# EAGLE schematic FPGA_Board (EAGLE 6.1)
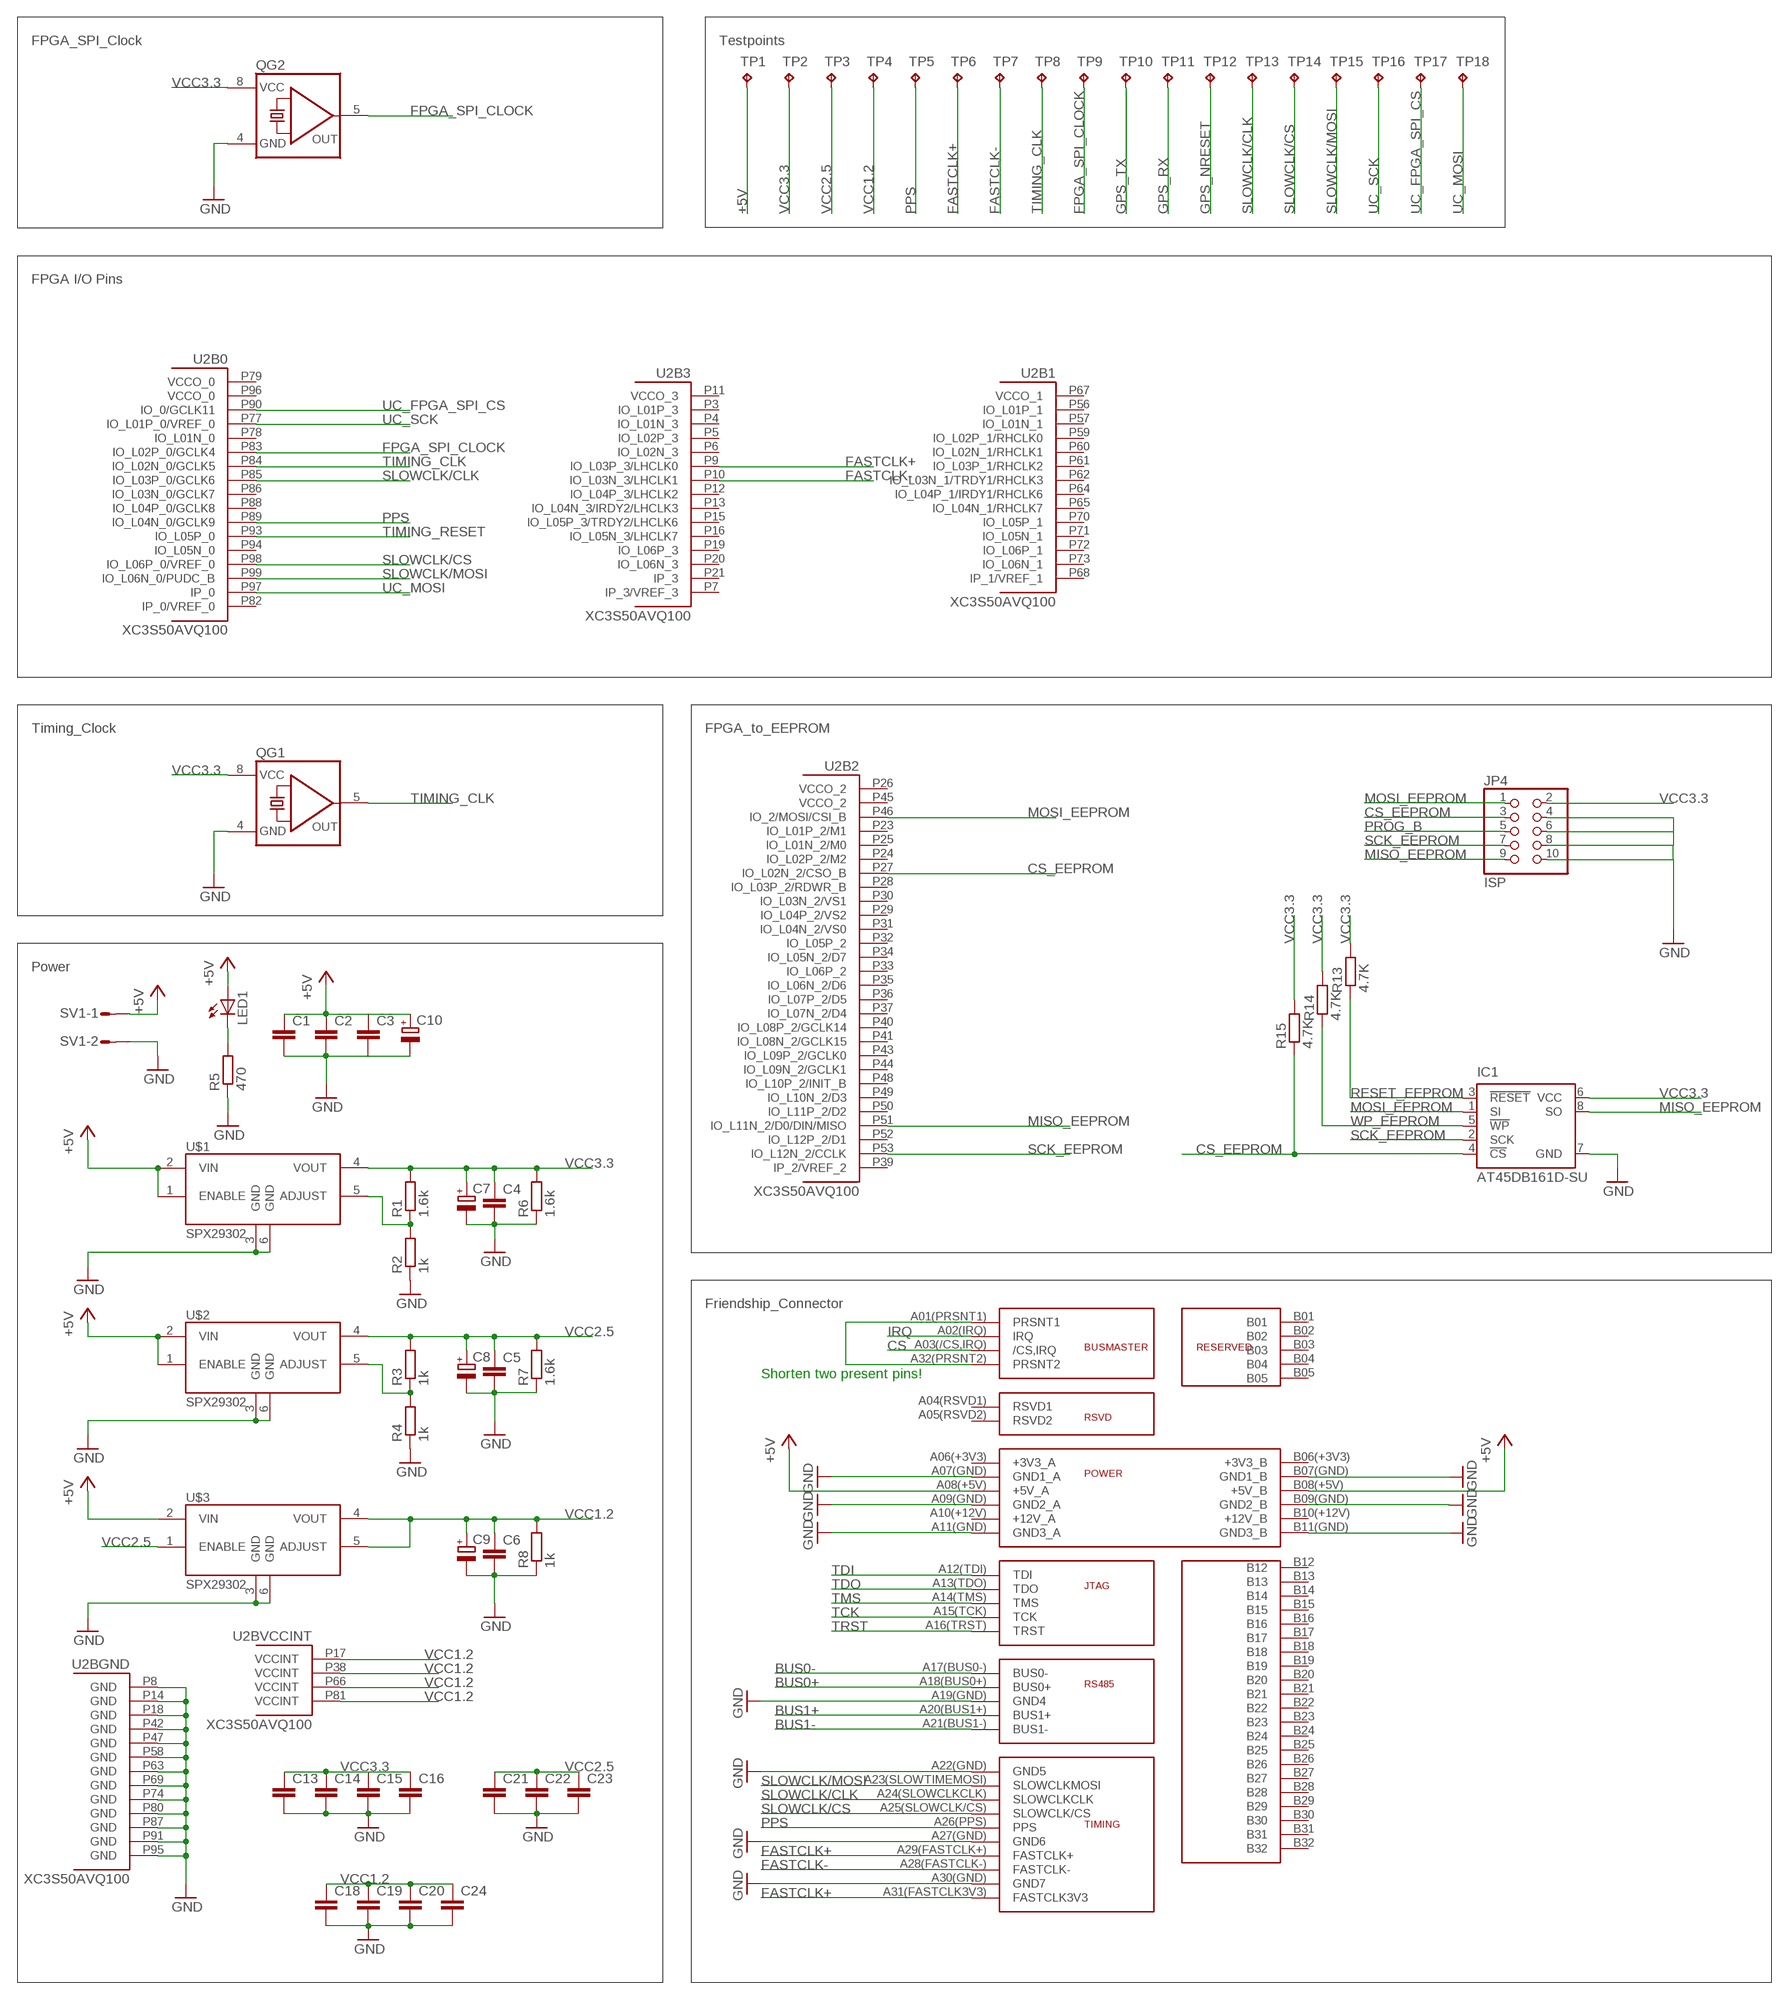
[diagram p0: schematic, sheet 1, part 1 of 2]
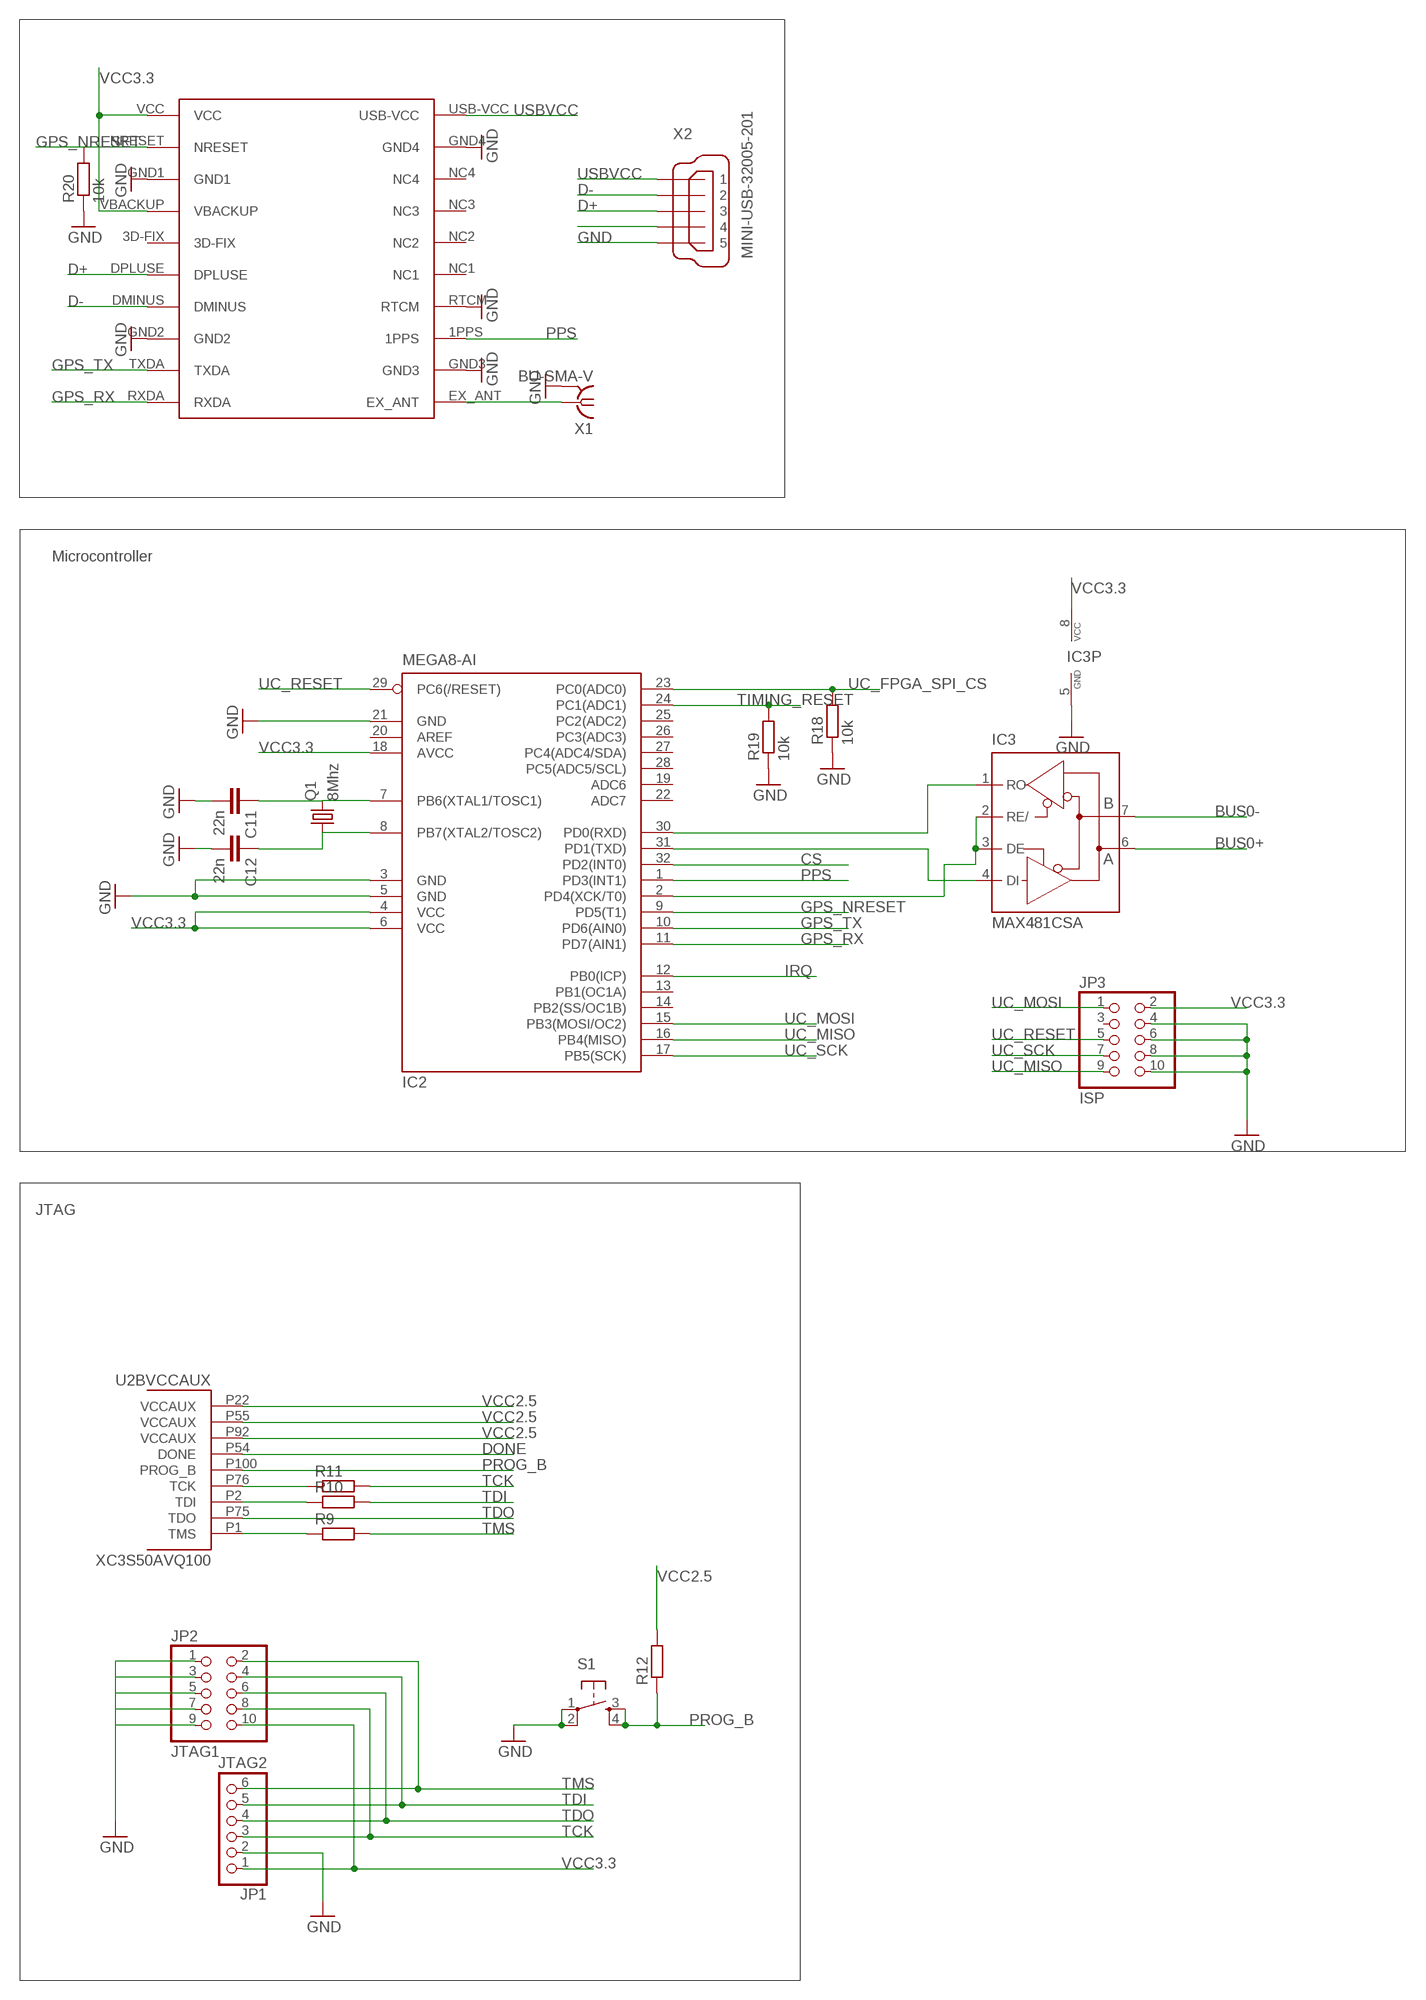
[diagram p1: schematic, sheet 1, part 2 of 2]

## Parts
C1  C-EUC0805  [C0805]
C2  C-EUC0805  [C0805]
C3  C-EUC0805  [C0805]
C4  C-EUC0805  [C0805]
C5  C-EUC0805  [C0805]
C6  C-EUC0805  [C0805]
C7  CPOL-EU085CS-1AR  [085CS_1AR]
C8  CPOL-EU085CS-1AR  [085CS_1AR]
C9  CPOL-EU085CS-1AR  [085CS_1AR]
C10  CPOL-EU085CS-1AR  [085CS_1AR]
C11  22n  C-EUC0805  [C0805]
C12  22n  C-EUC0805  [C0805]
C13  C-EUC0603  [C0603]
C14  C-EUC0603  [C0603]
C15  C-EUC0603  [C0603]
C16  C-EUC0603  [C0603]
C18  C-EUC0603  [C0603]
C19  C-EUC0603  [C0603]
C20  C-EUC0603  [C0603]
C21  C-EUC0603  [C0603]
C22  C-EUC0603  [C0603]
C23  C-EUC0603  [C0603]
C24  C-EUC0603  [C0603]
IC1  AT45DB161D-SU  [8S2]
IC2  MEGA8-AI  [TQFP32-08]
IC3  MAX481CSA  [SO08]
JP1  JTAG2  PINHD-1X6  [1X06]
JP2  JTAG1  PINHD-2X5  [2X05]
JP3  ISP  PINHD-2X5  [2X05]
JP4  ISP  PINHD-2X5  [2X05]
LED1  LEDCHIPLED_0805  [CHIPLED_0805]
Q1  8Mhz  CRYSTALHC49UP  [HC49UP]
QG1  QG5460  [DIL08S]
QG2  QG5460  [DIL08S]
R1  1.6k  R-EU_M0805  [M0805]
R2  1k  R-EU_M0805  [M0805]
R3  1k  R-EU_M0805  [M0805]
R4  1k  R-EU_M0805  [M0805]
R5  470  R-EU_M0805  [M0805]
R6  1.6k  R-EU_M0805  [M0805]
R7  1.6k  R-EU_M0805  [M0805]
R8  1k  R-EU_M0805  [M0805]
R9  R-EU_M0805  [M0805]
R10  R-EU_M0805  [M0805]
R11  R-EU_M0805  [M0805]
R12  R-EU_M0805  [M0805]
R13  4.7K  R-EU_M0805  [M0805]
R14  4.7K  R-EU_M0805  [M0805]
R15  4.7K  R-EU_M0805  [M0805]
R18  10k  R-EU_M0805  [M0805]
R19  10k  R-EU_M0805  [M0805]
R20  10k  R-EU_M0805  [M0805]
S1  TAC_SWITCHPTH  [TACTILE-PTH]
SV1  L02P  [L02P]
TP1  TPB2,54  [B2,54]
TP2  TPB2,54  [B2,54]
TP3  TPB2,54  [B2,54]
TP4  TPB2,54  [B2,54]
TP5  TPB2,54  [B2,54]
TP6  TPB2,54  [B2,54]
TP7  TPB2,54  [B2,54]
TP8  TPB2,54  [B2,54]
TP9  TPB2,54  [B2,54]
TP10  TPB2,54  [B2,54]
TP11  TPB2,54  [B2,54]
TP12  TPB2,54  [B2,54]
TP13  TPB2,54  [B2,54]
TP14  TPB2,54  [B2,54]
TP15  TPB2,54  [B2,54]
TP16  TPB2,54  [B2,54]
TP17  TPB2,54  [B2,54]
TP18  TPB2,54  [B2,54]
U2  XC3S50AVQ100  [VQ100]
U$1  SPX29302  [Q5-DD_SPX29300]
U$2  SPX29302  [Q5-DD_SPX29300]
U$3  SPX29302  [Q5-DD_SPX29300]
U$4  FRIENDSHIPCONNECTOR  [FRIENDSHIP_EDGE_CONNECTOR]
U$5  HGG_LOGO  [HGG_LOGO]
U$6  GPS  [GPS]
X1  BU-SMA-V  [BU-SMA-V]
X2  MINI-USB-32005-201  [32005-201]

## Nets
+5V: C1.1 C2.1 C3.1 C10.+ LED1.A SV1.1 TP1.TP U$1.1(ENABLE) U$1.2(VIN) U$2.1(ENABLE) U$2.2(VIN) U$3.2(VIN) U$4.A08(+5V)(+5V_A) U$4.B08(+5V)(+5V_B)
BUS0+: IC3.6(A) U$4.A18(BUS0+)(BUS0+)
BUS0-: IC3.7(B) U$4.A17(BUS0-)(BUS0-)
BUS1+: U$4.A20(BUS1+)(BUS1+)
BUS1-: U$4.A21(BUS1-)(BUS1-)
CS: IC2.32(PD2(INT0)) U$4.A03(/CS,IRQ)(/CS,IRQ)
CS_EEPROM: IC1.4(!CS) JP4.3 R15.1 U2.P27(B2:IO_L02N_2/CSO_B)
D+: U$6.DPLUSE X2.3
D-: U$6.DMINUS X2.2
DI: IC2.31(PD1(TXD)) IC3.4(DI)
DO: IC2.30(PD0(RXD)) IC3.1(RO)
DONE: U2.P54(BVCCAUX:DONE)
FASTCLK+: TP6.TP U2.P9(B3:IO_L03P_3/LHCLK0) U$4.A29(FASTCLK+)(FASTCLK+) U$4.A31(FASTCLK3V3)(FASTCLK3V3)
FASTCLK-: TP7.TP U2.P10(B3:IO_L03N_3/LHCLK1) U$4.A28(FASTCLK-)(FASTCLK-)
FPGA_SPI_CLOCK: QG2.5(OUT) TP9.TP U2.P83(B0:IO_L02P_0/GCLK4)
GND: C1.2 C2.2 C3.2 C4.2 C5.2 C6.2 C7.- C8.- C9.- C10.- C11.2 C12.2 C13.2 C14.2 C15.2 C16.2 C18.2 C19.2 C20.2 C21.2 C22.2 C23.2 C24.2 IC1.7(GND) IC2.3(GND) IC2.5(GND) IC2.21(GND) IC3.5(GND) JP1.2 JP2.1 JP2.3 JP2.5 JP2.7 JP2.9 JP3.4 JP3.6 JP3.8 JP3.10 JP4.4 JP4.6 JP4.8 JP4.10 QG1.4(GND) QG2.4(GND) R2.1 R4.1 R5.1 R6.1 R7.1 R8.1 R18.1 R19.1 R20.1 S1.1 S1.2 SV1.2 U2.P8(BGND:GND) U2.P14(BGND:GND) U2.P18(BGND:GND) U2.P42(BGND:GND) U2.P47(BGND:GND) U2.P58(BGND:GND) U2.P63(BGND:GND) U2.P69(BGND:GND) U2.P74(BGND:GND) U2.P80(BGND:GND) U2.P87(BGND:GND) U2.P91(BGND:GND) U2.P95(BGND:GND) U$1.3(GND) U$1.6(GND) U$2.3(GND) U$2.6(GND) U$3.3(GND) U$3.6(GND) U$4.A07(GND)(GND1_A) U$4.A09(GND)(GND2_A) U$4.A11(GND)(GND3_A) U$4.A19(GND)(GND4) U$4.A22(GND)(GND5) U$4.A27(GND)(GND6) U$4.A30(GND)(GND7) U$4.B07(GND)(GND1_B) U$4.B09(GND)(GND2_B) U$4.B11(GND)(GND3_B) U$6.GND1 U$6.GND2 U$6.GND3 U$6.GND4 U$6.RTCM X1.2(GND) X2.5
GPS_NRESET: IC2.9(PD5(T1)) R20.2 TP12.TP U$6.NRESET
GPS_RX: IC2.11(PD7(AIN1)) TP11.TP U$6.RXDA
GPS_TX: IC2.10(PD6(AIN0)) TP10.TP U$6.TXDA
IRQ: IC2.12(PB0(ICP)) U$4.A02(IRQ)(IRQ)
MISO_EEPROM: IC1.8(SO) JP4.9 U2.P51(B2:IO_L11N_2/D0/DIN/MISO)
MOSI_EEPROM: IC1.1(SI) JP4.1 U2.P46(B2:IO_2/MOSI/CSI_B)
N$1: R11.1 U2.P76(BVCCAUX:TCK)
N$2: R10.1 U2.P2(BVCCAUX:TDI)
N$3: LED1.C R5.2
N$4: R9.1 U2.P1(BVCCAUX:TMS)
N$5: IC2.2(PD4(XCK/T0)) IC3.2(RE/) IC3.3(DE)
N$7: R1.1 R2.2 U$1.5(ADJUST)
N$8: R3.1 R4.2 U$2.5(ADJUST)
N$11: C11.1 IC2.7(PB6(XTAL1/TOSC1)) Q1.2
N$12: C12.1 IC2.8(PB7(XTAL2/TOSC2)) Q1.1
N$13: U$4.A01(PRSNT1)(PRSNT1) U$4.A32(PRSNT2)(PRSNT2)
N$14: U$6.EX_ANT X1.1
N$15: X2.4
PPS: IC2.1(PD3(INT1)) TP5.TP U2.P89(B0:IO_L04N_0/GCLK9) U$4.A26(PPS)(PPS) U$6.1PPS
PROG_B: JP4.5 R12.1 S1.3 S1.4 U2.P100(BVCCAUX:PROG_B)
RESET_EEPROM: IC1.3(!RESET) R13.1
SCK_EEPROM: IC1.2(SCK) JP4.7 U2.P53(B2:IO_L12N_2/CCLK)
SLOWCLK/CLK: TP13.TP U2.P85(B0:IO_L03P_0/GCLK6) U$4.A24(SLOWCLKCLK)(SLOWCLKCLK)
SLOWCLK/CS: TP14.TP U2.P98(B0:IO_L06P_0/VREF_0) U$4.A25(SLOWCLK/CS)(SLOWCLK/CS)
SLOWCLK/MOSI: TP15.TP U2.P99(B0:IO_L06N_0/PUDC_B) U$4.A23(SLOWTIMEMOSI)(SLOWCLKMOSI)
TCK: JP1.3 JP2.8 R11.2 U$4.A15(TCK)(TCK)
TDI: JP1.5 JP2.4 R10.2 U$4.A12(TDI)(TDI)
TDO: JP1.4 JP2.6 U2.P75(BVCCAUX:TDO) U$4.A13(TDO)(TDO)
TIMING_CLK: QG1.5(OUT) TP8.TP U2.P84(B0:IO_L02N_0/GCLK5)
TIMING_RESET: IC2.24(PC1(ADC1)) R19.2 U2.P93(B0:IO_L05P_0)
TMS: JP1.6 JP2.2 R9.2 U$4.A14(TMS)(TMS)
TRST: U$4.A16(TRST)(TRST)
UC_FPGA_SPI_CS: IC2.23(PC0(ADC0)) R18.2 TP17.TP U2.P90(B0:IO_0/GCLK11)
UC_MISO: IC2.16(PB4(MISO)) JP3.9
UC_MOSI: IC2.15(PB3(MOSI/OC2)) JP3.1 TP18.TP U2.P97(B0:IP_0)
UC_RESET: IC2.29(PC6(/RESET)) JP3.5
UC_SCK: IC2.17(PB5(SCK)) JP3.7 TP16.TP U2.P77(B0:IO_L01P_0/VREF_0)
USBVCC: U$6.USB-VCC X2.1
VCC1.2: C6.1 C9.+ C18.1 C19.1 C20.1 C24.1 R8.2 TP4.TP U2.P17(BVCCINT:VCCINT) U2.P38(BVCCINT:VCCINT) U2.P66(BVCCINT:VCCINT) U2.P81(BVCCINT:VCCINT) U$3.4(VOUT) U$3.5(ADJUST)
VCC2.5: C5.1 C8.+ C21.1 C22.1 C23.1 R3.2 R7.2 R12.2 TP3.TP U2.P22(BVCCAUX:VCCAUX) U2.P55(BVCCAUX:VCCAUX) U2.P92(BVCCAUX:VCCAUX) U$2.4(VOUT) U$3.1(ENABLE)
VCC3.3: C4.1 C7.+ C13.1 C14.1 C15.1 C16.1 IC1.6(VCC) IC2.4(VCC) IC2.6(VCC) IC2.18(AVCC) IC3.8(VCC) JP1.1 JP2.10 JP3.2 JP4.2 QG1.8(VCC) QG2.8(VCC) R1.2 R6.2 R13.2 R14.2 R15.2 TP2.TP U$1.4(VOUT) U$6.VBACKUP U$6.VCC
WP_EEPROM: IC1.5(!WP) R14.1
Unconnected: IC2.13(PB1(OC1A)) IC2.14(PB2(SS/OC1B)) IC2.19(ADC6) IC2.20(AREF) IC2.22(ADC7) IC2.25(PC2(ADC2)) IC2.26(PC3(ADC3)) IC2.27(PC4(ADC4/SDA)) IC2.28(PC5(ADC5/SCL)) JP3.3 U2.P3(B3:IO_L01P_3) U2.P4(B3:IO_L01N_3) U2.P5(B3:IO_L02P_3) U2.P6(B3:IO_L02N_3) U2.P7(B3:IP_3/VREF_3) U2.P11(B3:VCCO_3) U2.P12(B3:IO_L04P_3/LHCLK2) U2.P13(B3:IO_L04N_3/IRDY2/LHCLK3) U2.P15(B3:IO_L05P_3/TRDY2/LHCLK6) U2.P16(B3:IO_L05N_3/LHCLK7) U2.P19(B3:IO_L06P_3) U2.P20(B3:IO_L06N_3) U2.P21(B3:IP_3) U2.P23(B2:IO_L01P_2/M1) U2.P24(B2:IO_L02P_2/M2) U2.P25(B2:IO_L01N_2/M0) U2.P26(B2:VCCO_2) U2.P28(B2:IO_L03P_2/RDWR_B) U2.P29(B2:IO_L04P_2/VS2) U2.P30(B2:IO_L03N_2/VS1) U2.P31(B2:IO_L04N_2/VS0) U2.P32(B2:IO_L05P_2) U2.P33(B2:IO_L06P_2) U2.P34(B2:IO_L05N_2/D7) U2.P35(B2:IO_L06N_2/D6) U2.P36(B2:IO_L07P_2/D5) U2.P37(B2:IO_L07N_2/D4) U2.P39(B2:IP_2/VREF_2) U2.P40(B2:IO_L08P_2/GCLK14) U2.P41(B2:IO_L08N_2/GCLK15) U2.P43(B2:IO_L09P_2/GCLK0) U2.P44(B2:IO_L09N_2/GCLK1) U2.P45(B2:VCCO_2) U2.P48(B2:IO_L10P_2/INIT_B) U2.P49(B2:IO_L10N_2/D3) U2.P50(B2:IO_L11P_2/D2) U2.P52(B2:IO_L12P_2/D1) U2.P56(B1:IO_L01P_1) U2.P57(B1:IO_L01N_1) U2.P59(B1:IO_L02P_1/RHCLK0) U2.P60(B1:IO_L02N_1/RHCLK1) U2.P61(B1:IO_L03P_1/RHCLK2) U2.P62(B1:IO_L03N_1/TRDY1/RHCLK3) U2.P64(B1:IO_L04P_1/IRDY1/RHCLK6) U2.P65(B1:IO_L04N_1/RHCLK7) U2.P67(B1:VCCO_1) U2.P68(B1:IP_1/VREF_1) U2.P70(B1:IO_L05P_1) U2.P71(B1:IO_L05N_1) U2.P72(B1:IO_L06P_1) U2.P73(B1:IO_L06N_1) U2.P78(B0:IO_L01N_0) U2.P79(B0:VCCO_0) U2.P82(B0:IP_0/VREF_0) U2.P86(B0:IO_L03N_0/GCLK7) U2.P88(B0:IO_L04P_0/GCLK8) U2.P94(B0:IO_L05N_0) U2.P96(B0:VCCO_0) U$4.A04(RSVD1)(RSVD1) U$4.A05(RSVD2)(RSVD2) U$4.A06(+3V3)(+3V3_A) U$4.A10(+12V)(+12V_A) U$4.B01 U$4.B02 U$4.B03 U$4.B04 U$4.B05 U$4.B06(+3V3)(+3V3_B) U$4.B10(+12V)(+12V_B) U$4.B12 U$4.B13 U$4.B14 U$4.B15 U$4.B16 U$4.B17 U$4.B18 U$4.B19 U$4.B20 U$4.B21 U$4.B22 U$4.B23 U$4.B24 U$4.B25 U$4.B26 U$4.B27 U$4.B28 U$4.B29 U$4.B30 U$4.B31 U$4.B32 U$6.3D-FIX U$6.NC1 U$6.NC2 U$6.NC3 U$6.NC4

## Notes on the sheet
- FPGA_SPI_Clock | Testpoints
- FPGA I/O Pins
- Timing_Clock | FPGA_to_EEPROM | Microcontroller
- Power
- Friendship_Connector | JTAG
- Shorten two present pins!

## Power pins joined to a net without a drawn wire
GND: X1.3(GND) X1.4(GND) X1.5(GND)

## Library data of the parts
C1-C6 C11-C16 C18-C24 = resistor:C-EU: CAPACITOR, European symbol
C7-C10 = resistor:CPOL-EU: POLARIZED CAPACITOR, European symbol
IC1 = atmel:AT45DB161D: 16-megabit 2.5V or 2.7V DataFlash Source: http://www.atmel.com/dyn/resources/prod_documents/doc3500.pdf; MF: ATMEL; MPN: AT45DB161D-SU; OC_FARNELL: 1455040
IC2 = atmel:MEGA8: MICROCONTROLLER 8 Kbytes FLASH, 1 kbytes SRAM, 512 bytes EEPROM, USART, 6-channel 10 bit ADC, 2-channel 8 bit ADC Pin compatible with Atmega48, ATMega88, ATMega168 Source: avr.lbr; MPN: ATMEGA8-16AU; OC_FARNELL: 9171371; OC_NEWARK: 73M8863
IC3 = maxim:MAX481CSA: RS485 TRANSEIVER; MF: MAXIM; MPN: MAX481CSA; OC_FARNELL: unknown; OC_NEWARK: 90C3817
JP1 = pinhead:PINHD-1X6: PIN HEADER
JP2-JP4 = pinhead:PINHD-2X5: PIN HEADER
LED1 = led:LED: LED OSRAM: - CHIPLED LG R971, LG N971, LY N971, LG Q971, LY Q971, LO R971, LY R971 LH N974, LH R974 LS Q976, LO Q976, LY Q976 LO Q996 - Hyper CHIPLED LW Q18S LB Q993, LB Q99A, LB R99A - SideLED LS A670, LO A670, LY A670, LG A670, LP A670 LB A673, LV A673, LT A673, LW A673 LH A674 LY A675 LS A676, LA A676, LO A676, LY A676, LW A676 LS A679, LY A679, LG A679 - Hyper Micro SIDELED® LS Y876, LA Y876, LO Y876, LY Y876 LT Y87S - SmartLED LW L88C, LW L88S LB L89C, LB L89S, LG L890 LS L89K, LO L89K, LY L89K LS L896, LA L896, LO L896, LY L896 - TOPLED LS T670, LO T670, LY T670, LG T670, LP T670 LSG T670, LSP T670, LSY T670, LOP T670, LYG T670 LG T671, LOG T671, LSG T671 LB T673, LV T673, LT T673, LW T673 LH T674 LS T676, LA T676, LO T676, LY T676, LB T676, LH T676, LSB T676, LW T676 LB T67C, LV T67C, LT T67C, LS T67K, LO T67K, LY T67K, LW E67C LS E67B, LA E67B, LO E67B, LY E67B, LB E67C, LV E67C, LT E67C LW T67C LS T679, LY T679, LG T679 LS T770, LO T770, LY T770, LG T770, LP T770 LB T773, LV T773, LT T773, LW T773 LH T774 LS E675, LA E675, LY E675, LS T675 LS T776, LA T776, LO T776, LY T776, LB T776 LHGB T686 LT T68C, LB T68C - Hyper Mini TOPLED® LB M676 - Mini TOPLED Santana® LG M470 LS M47K, LO M47K, LY M47K Source: http://www.osram.convergy.de LUXEON: - LUMILED® LXK2-PW12-R00, LXK2-PW12-S00, LXK2-PW14-U00, LXK2-PW14-V00 LXK2-PM12-R00, LXK2-PM12-S00, LXK2-PM14-U00 LXK2-PE12-Q00, LXK2-PE12-R00, LXK2-PE12-S00, LXK2-PE14-T00, LXK2-PE14-U00 LXK2-PB12-K00, LXK2-PB12-L00, LXK2-PB12-M00, LXK2-PB14-N00, LXK2-PB14-P00, LXK2-PB14-Q00 LXK2-PR12-L00, LXK2-PR12-M00, LXK2-PR14-Q00, LXK2-PR14-R00 LXK2-PD12-Q00, LXK2-PD12-R00, LXK2-PD12-S00 LXK2-PH12-R00, LXK2-PH12-S00 LXK2-PL12-P00, LXK2-PL12-Q00, LXK2-PL12-R00 Source: www.luxeon.com KINGBRIGHT: KA-3528ASYC Source: www.kingbright.com
Q1 = crystal:CRYSTAL: CRYSTAL; OC_FARNELL: unknown; OC_NEWARK: unknown
QG1 QG2 = crystal:QG5460: CRYSTAL RESONATOR; OC_FARNELL: unknown; OC_NEWARK: unknown
R1-R15 R18-R20 = resistor:R-EU_: RESISTOR, European symbol
S1 = SparkFun:TAC_SWITCH: Momentary Switch Button commonly used for reset or general input. Spark Fun Electronics SKU : COM-00097
SV1 = con-amp-mt:L02P: AMP MT CONNECTOR; OC_FARNELL: unknown; OC_NEWARK: unknown
TP1-TP18 = testpad:TP: Test pad
U2 = xilinx_devices:XC3S50AVQ100: Xilinx FPGA: XC3S50AVQ100
U$1-U$3 = SparkFun:SPX29302
U$4 = hgg:FRIENDSHIP
U$5 = hgg:HGG_LOGO
U$6 = hgg:GPS
X1 = con-coax:BU-SMA-V: FEMALE SMA CONNECTOR Radiall distributor RS 112-3794; OC_FARNELL: unknown; OC_NEWARK: unknown
X2 = con-cypressindustries:MINI-USB-: MINI USB-B Conector Source: www.cypressindustries.com; OC_FARNELL: unknown; OC_NEWARK: unknown